# EAGLE design rgb_driver (EAGLE 9.6.2)
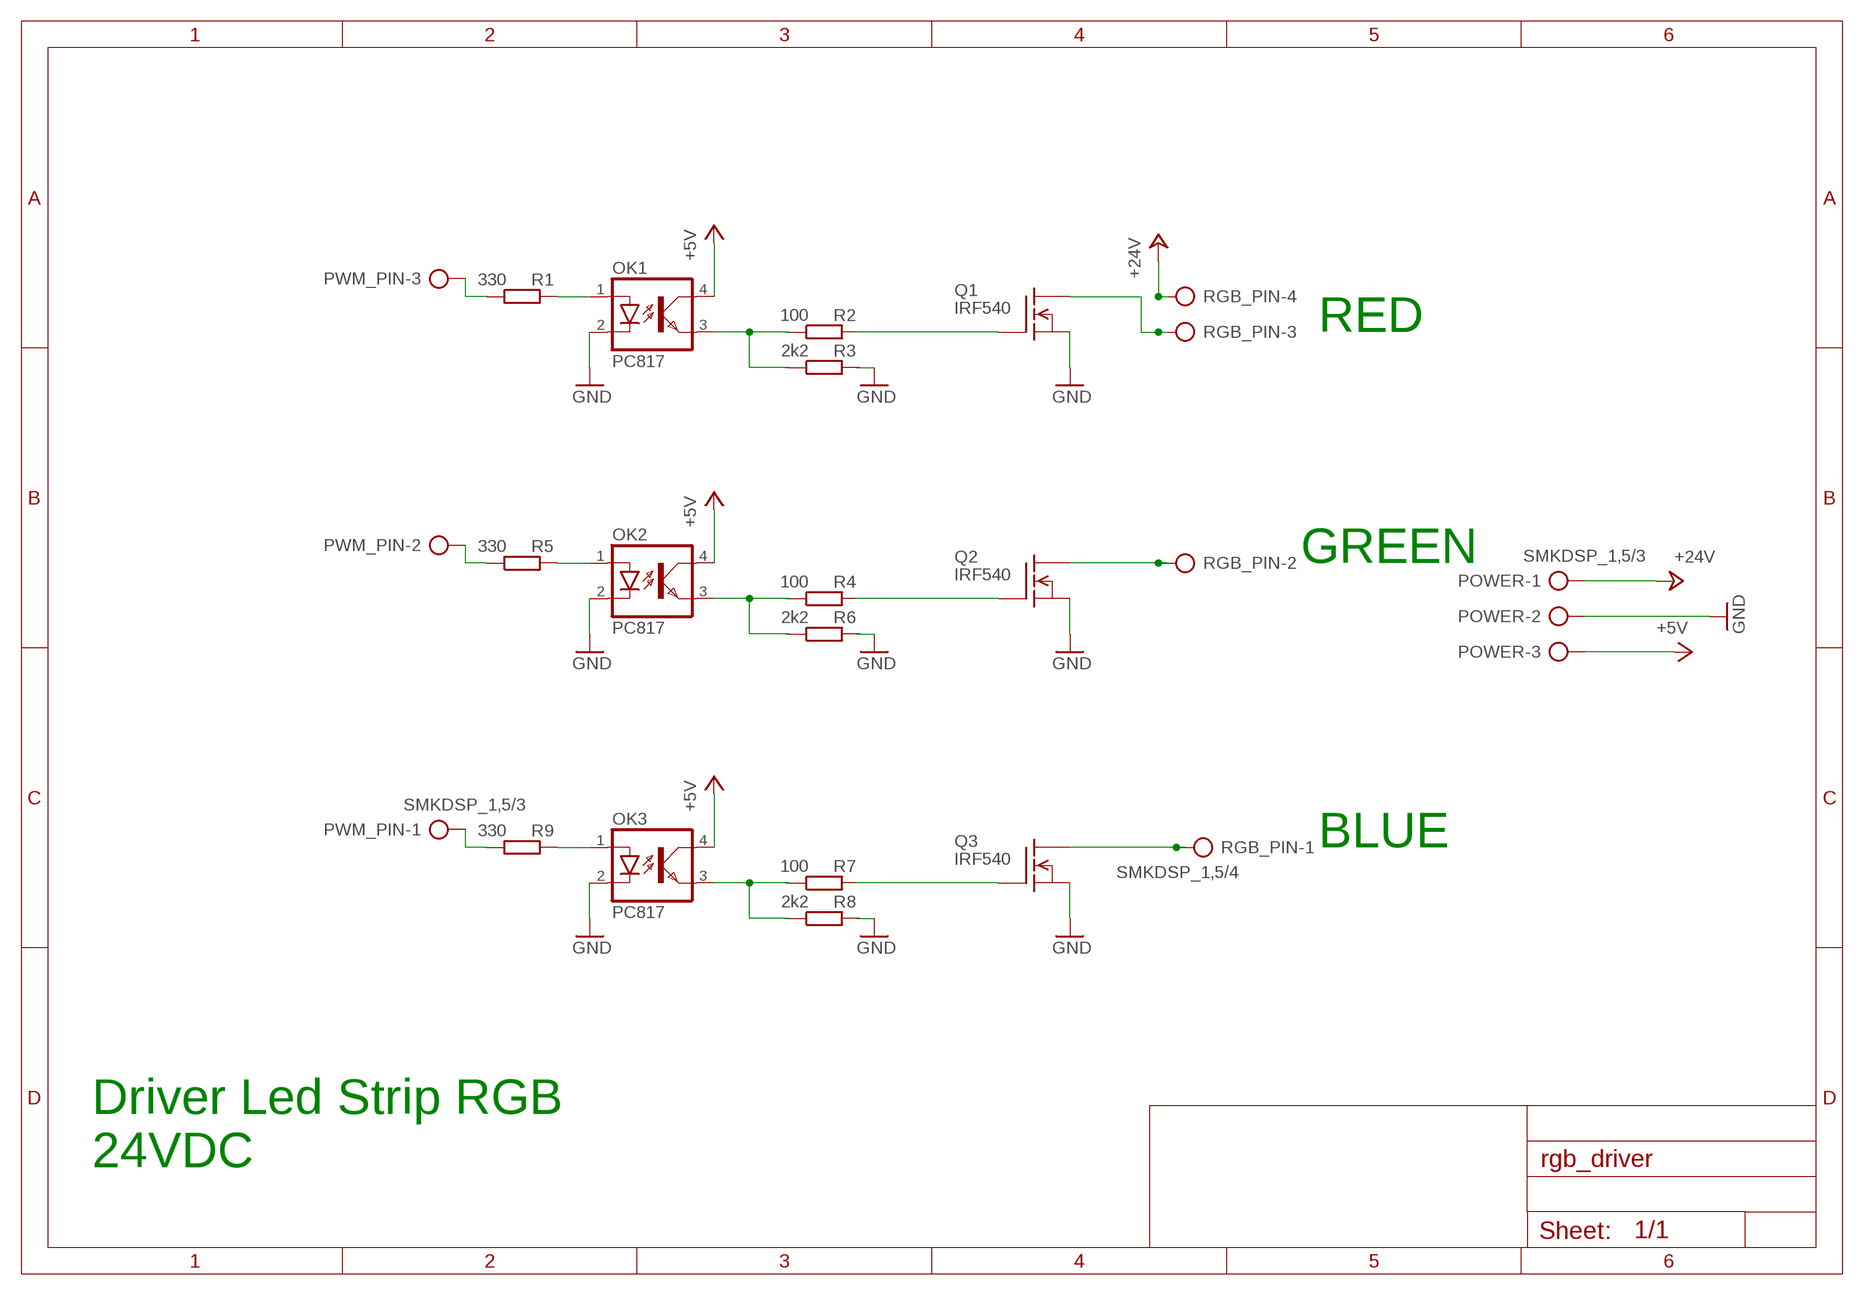
[diagram p0: schematic, sheet 1]

## Parts
OK1  PC817  [DIL04]
OK2  PC817  [DIL04]
OK3  PC817  [DIL04]
POWER  SMKDSP_1,5/3  [SMKDSP_1,5/3]
PWM_PIN  SMKDSP_1,5/3  [SMKDSP_1,5/3]
Q1  IRF540  [TO220]
Q2  IRF540  [TO220]
Q3  IRF540  [TO220]
R1  330  R-EU_0207/10  [0207/10]
R2  100  R-EU_0207/10  [0207/10]
R3  2k2  R-EU_0207/10  [0207/10]
R4  100  R-EU_0207/10  [0207/10]
R5  330  R-EU_0207/10  [0207/10]
R6  2k2  R-EU_0207/10  [0207/10]
R7  100  R-EU_0207/10  [0207/10]
R8  2k2  R-EU_0207/10  [0207/10]
R9  330  R-EU_0207/10  [0207/10]
RGB_PIN  SMKDSP_1,5/4  [SMKDSP_1,5/4]

## Nets
+5V: OK1.4(COL) OK2.4(COL) OK3.4(COL) POWER.3
+24V: POWER.1 RGB_PIN.4
BLUE_LED: Q3.2(D) RGB_PIN.1
GND: OK1.2(C) OK2.2(C) OK3.2(C) POWER.2 Q1.3(S) Q2.3(S) Q3.3(S) R3.2 R6.2 R8.2
GREEN_LED: Q2.2(D) RGB_PIN.2
N$1: OK1.3(EMIT) R2.1 R3.1
N$3: Q1.1(G) R2.2
N$5: OK2.3(EMIT) R4.1 R6.1
N$8: Q2.1(G) R4.2
N$11: OK3.3(EMIT) R7.1 R8.1
N$13: Q3.1(G) R7.2
N$16: OK1.1(A) R1.2
N$17: OK2.1(A) R5.2
N$18: OK3.1(A) R9.2
PWM_BLUE: PWM_PIN.1 R9.1
PWM_GREEN: PWM_PIN.2 R5.1
PWM_RED: PWM_PIN.3 R1.1
RED_LED: Q1.2(D) RGB_PIN.3

## Notes on the sheet
- RED
- GREEN
- BLUE
- Driver Led Strip RGB
- 24VDC

## Library data of the parts
OK1-OK3 = optocoupler:PC817: SHARP OPTO COUPLER; MPN: PC817X4J000F; OC_FARNELL: 9707727; OC_NEWARK: 97K7059
POWER PWM_PIN = con-phoenix-smkdsp:SMKDSP_1,5/3: Printklemme, Nennstrom: 17,5 A, Bemessungsspannung: 250 V, Raster: 5,0 mm Source: http://eshop.phoenixcontact.de .. 1733415.pdf; MF: FARNELL; MPN: 1733583; OC_FARNELL: 3041256; OC_NEWARK: 71C4130
Q1-Q3 = transistor-fet:IRF540: N-Channel Enhancement MOSFET (HEXFET); 100V; 28A; 0,077Ohm
R1-R9 = resistor:R-EU_: RESISTOR, European symbol
RGB_PIN = con-phoenix-smkdsp:SMKDSP_1,5/4: Printklemme, Nennstrom: 17,5 A, Bemessungsspannung: 250 V, Raster: 5,0 mm Source: http://eshop.phoenixcontact.de .. 1733415.pdf; MF: FARNELL; MPN: 1733596; OC_FARNELL: 3041268; OC_NEWARK: 71C4131

## Board
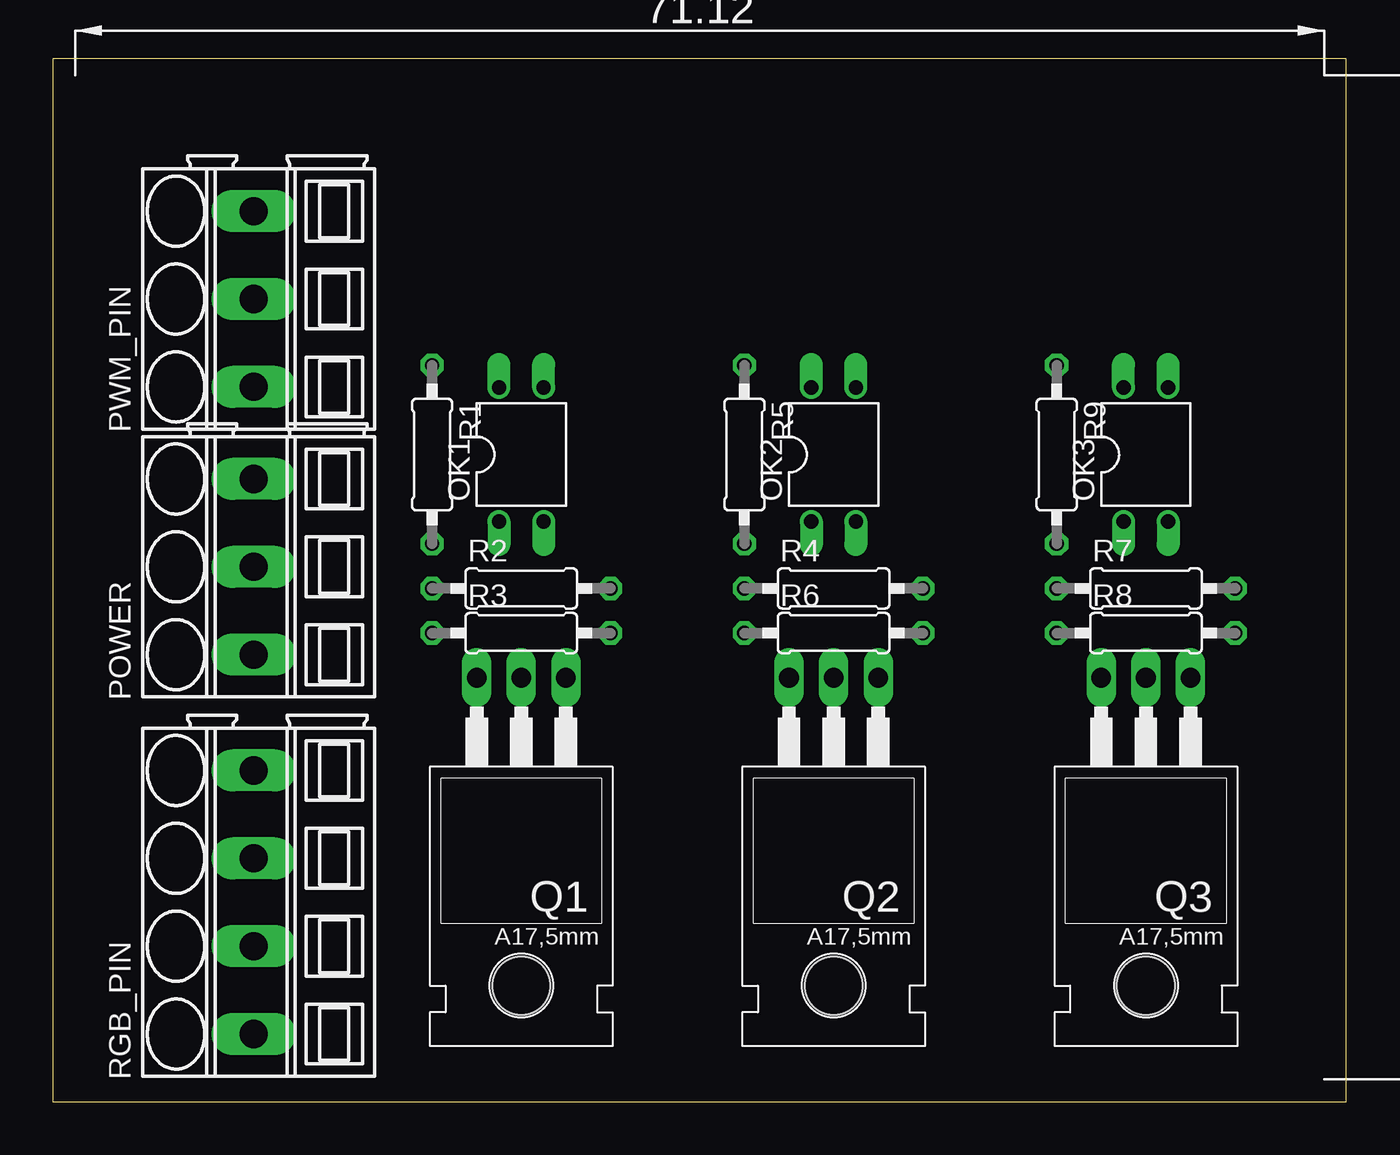
[diagram p1: board, top side]
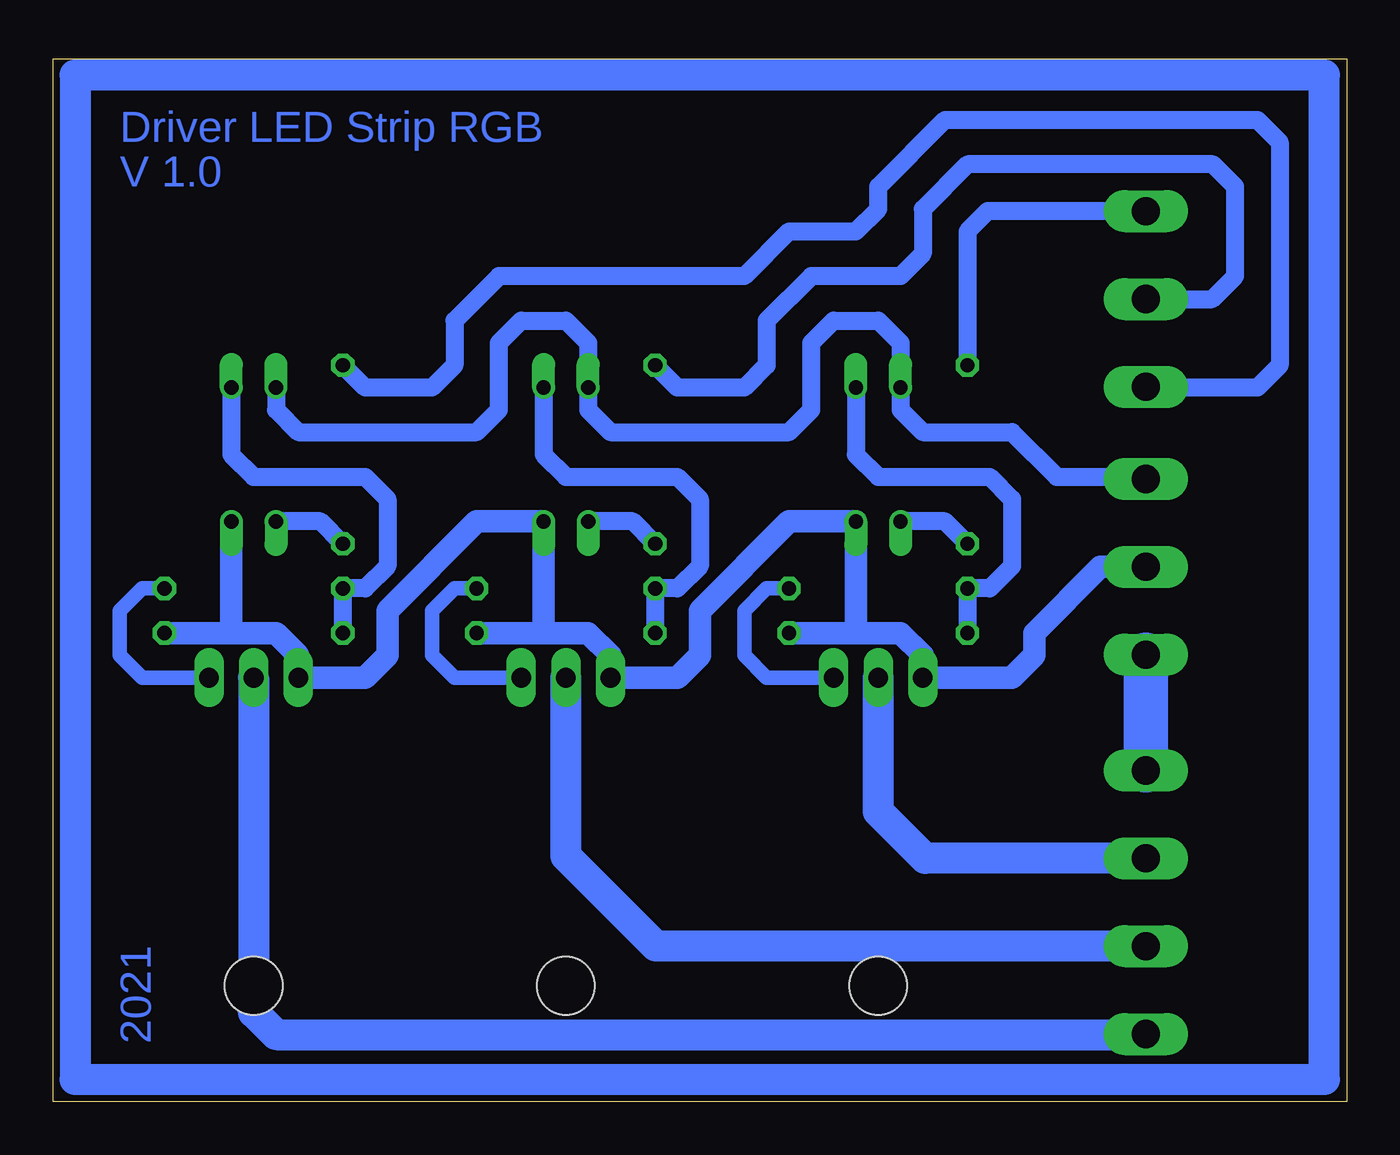
[diagram p2: board, bottom side, seen from below]

Size 73.64 x 59.36 mm. Coordinates in mm from the lower left corner, seen from the top.
Outline: 0,0 73.64,0 73.64,59.36 0,59.36 0,0
Copper layers (1*16): Top 0.035mm / dielectric 1.5mm / Bottom 0.035mm
Design rules "default": minimum track width 10mil, minimum drill 24mil, track to track 8mil, track to pad 8mil, pad to pad 8mil, via to via 8mil, smd to smd 8mil, copper to edge 40mil, drill to drill 8mil, minimum pad ring 10mil, minimum via ring 8mil, stop-mask expansion 4mil, vias tented up to drill 0mil, thermal gap 10mil

### Footprints (pad centres in the part's own frame; a part is rotated, then mirrored left to right if it is on the bottom)
DIL04 = drill 0.813 offset: 1 -1.27,-3.81; 2 1.27,-3.81; 3 1.27,3.81; 4 -1.27,3.81
SMKDSP_1,5/3 = drill 1.6 pad 1.8 long: 1 -2.5,0; 2 2.5,0; 3 7.5,0
TO220 = drill 1.118 long: 1 -2.54,-6.35; 2 0,-6.35; 3 2.54,-6.35 | hole 3.302: 0,11.176
0207/10 = drill 0.813 octagon: 1 -5.08,0; 2 5.08,0
SMKDSP_1,5/4 = drill 1.6 pad 1.8 long: 1 -2.5,0; 2 2.5,0; 3 7.5,0; 4 12.5,0

### Placement (x,y rotation side)
OK1  26.67,36.83 0 top
OK2  44.45,36.83 0 top
OK3  62.23,36.83 0 top
POWER  11.43,27.94 90 top
PWM_PIN  11.43,43.18 90 top
Q1  26.67,17.78 180 top
Q2  44.45,17.78 180 top
Q3  62.23,17.78 180 top
R1  21.59,36.83 270 top
R2  26.67,29.21 0 top
R3  26.67,26.67 0 top
R4  44.45,29.21 0 top
R5  39.37,36.83 270 top
R6  44.45,26.67 0 top
R7  62.23,29.21 0 top
R8  62.23,26.67 0 top
R9  57.15,36.83 270 top
RGB_PIN  11.43,6.35 90 top

### Tracks (layer width: path | path; a pad name or v marks a point on that pad's centre or on a via)
+5V
  Bottom 0.813: POWER.3 11.43,35.52 11.47,35.56
  Bottom 1.016: OK3.4 60.96,39.37 59.69,38.1 49.53,38.1 48.26,39.37 48.26,43.18 46.99,44.45 44.45,44.45 43.18,43.18 OK2.4 43.18,39.37 41.91,38.1 31.75,38.1 30.48,39.37 30.48,43.18 29.21,44.45 26.67,44.45 25.4,43.18 OK1.4 25.4,39.37 24.13,38.1 19.05,38.1 16.51,35.56 11.47,35.56
+24V
  Bottom 2.54: POWER.1 RGB_PIN.4
BLUE_LED
  Bottom 1.778: Q3.2 62.23,5.08 60.96,3.81 11.47,3.81 RGB_PIN.1
GND
  Bottom 1.27: R8.2 63.5,26.67 | 63.5,26.67 60.96,26.67 59.69,25.4 Q3.3 55.88,24.13 54.61,25.4 54.61,27.94 49.53,33.02 OK2.2 45.72,26.67 | OK3.2 63.5,26.67 | 45.72,26.67 R6.2 | 27.94,26.67 OK1.2 31.75,33.02 36.83,27.94 36.83,25.4 38.1,24.13 Q2.3 41.91,25.4 43.18,26.67 45.72,26.67 | 27.94,26.67 R3.2 | 27.94,26.67 25.4,26.67 24.13,25.4 Q1.3 19.05,24.13 17.78,25.4 17.78,26.67 14.01,30.44 POWER.2
GREEN_LED
  Bottom 1.778: RGB_PIN.2 39.33,8.85 44.45,13.97 Q2.2
N$1
  Bottom 1.016: OK1.3 27.94,36.83 26.67,35.56 20.32,35.56 19.05,34.29 19.05,30.48 20.32,29.21 R2.1 R3.1
N$2
  Bottom 1.778: 1.27,58.42 72.39,58.42 72.39,1.27 1.27,1.27 1.27,58.42
N$3
  Bottom 0.813: Q1.1 33.02,24.13 34.29,25.4 34.29,27.94 33.02,29.21 R2.2
N$5
  Bottom 1.016: R6.1 R4.1 38.1,29.21 36.83,30.48 36.83,34.29 38.1,35.56 44.45,35.56 45.72,36.83 OK2.3
N$8
  Bottom 0.813: Q2.1 50.8,24.13 52.07,25.4 52.07,27.94 50.8,29.21 R4.2
N$11
  Bottom 1.016: R8.1 R7.1 55.88,29.21 54.61,30.48 54.61,34.29 55.88,35.56 62.23,35.56 63.5,36.83 OK3.3
N$13
  Bottom 0.813: Q3.1 68.58,24.13 69.85,25.4 69.85,27.94 68.58,29.21 R7.2
N$16
  Bottom 1.016: R1.2 22.86,33.02 OK1.1
N$17
  Bottom 1.016: R5.2 40.64,33.02 OK2.1
N$18
  Bottom 1.016: R9.2 58.42,33.02 OK3.1
PWM_BLUE
  Bottom 1.016: R9.1 55.88,40.64 52.07,40.64 50.8,41.91 50.8,44.45 48.26,46.99 34.29,46.99 31.75,49.53 27.94,49.53 26.67,50.8 26.67,52.07 22.86,55.88 5.08,55.88 3.81,54.61 3.81,41.91 5.08,40.64 11.39,40.64 PWM_PIN.1
PWM_GREEN
  Bottom 1.016: PWM_PIN.2 7.66,45.68 6.35,46.99 6.35,52.07 7.62,53.34 21.59,53.34 24.13,50.8 24.13,48.26 25.4,46.99 30.48,46.99 33.02,44.45 33.02,41.91 34.29,40.64 38.1,40.64 R5.1
PWM_RED
  Bottom 1.016: PWM_PIN.3 20.44,50.68 21.59,49.53 R1.1
RED_LED
  Bottom 1.778: RGB_PIN.3 24.01,13.85 26.67,16.51 Q1.2

### Text on the board
Bottom: Driver LED Strip RGB | V 1.0 | 2021